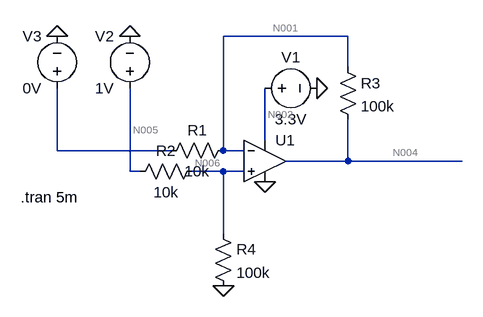
[diagram p0: schematic Draft1.asc]
Draft1.asc, the LTspice schematic file:
Version 4
SHEET 1 980 680
WIRE -272 -64 -464 -64
WIRE -272 -16 -272 -64
WIRE -400 96 -400 16
WIRE -720 112 -720 16
WIRE -544 112 -720 112
WIRE -464 112 -464 -64
WIRE -432 112 -464 112
WIRE -272 128 -272 64
WIRE -272 128 -368 128
WIRE -96 128 -272 128
WIRE -608 144 -608 16
WIRE -592 144 -608 144
WIRE -464 144 -512 144
WIRE -432 144 -464 144
WIRE -464 240 -464 144
FLAG -400 160 0
FLAG -320 16 0
FLAG -720 -64 0
FLAG -608 -64 0
FLAG -464 320 0
SYMBOL Linear_Original\\Opamps\\UniversalOpamp2 -400 128 R0
SYMATTR InstName U1
SYMBOL voltage -416 16 R270
WINDOW 0 32 56 VTop 2
WINDOW 3 -32 56 VBottom 2
SYMATTR InstName V1
SYMATTR Value 3.3V
SYMBOL voltage -608 32 R180
WINDOW 0 24 96 Left 2
WINDOW 3 24 16 Left 2
SYMATTR InstName V2
SYMATTR Value 1V
SYMBOL voltage -720 32 R180
WINDOW 0 24 96 Left 2
WINDOW 3 24 16 Left 2
SYMATTR InstName V3
SYMATTR Value 0V
SYMBOL res -448 96 R90
WINDOW 0 0 56 VBottom 2
WINDOW 3 32 56 VTop 2
SYMATTR InstName R1
SYMATTR Value 10k
SYMBOL res -496 128 R90
WINDOW 0 0 56 VBottom 2
WINDOW 3 32 56 VTop 2
SYMATTR InstName R2
SYMATTR Value 10k
SYMBOL res -288 -32 R0
SYMATTR InstName R3
SYMATTR Value 100k
SYMBOL res -480 224 R0
SYMATTR InstName R4
SYMATTR Value 100k
TEXT -776 184 Left 2 !.tran 5m

The netlist it stands for:
* Draft1.asc
XU1 N006 N001 N002 0 N004 level.2 Avol=1Meg GBW=10Meg Slew=10Meg ilimit=25m rail=0 Vos=0 phimargin=45 en=0 enk=0 in=0 ink=0 Rin=500Meg  ; pins IN+ IN- V+ V- OUT
V1 N002 0 3.3V
V2 N005 0 1V
V3 N003 0 0V
R1 N001 N003 10k
R2 N006 N005 10k
R3 N001 N004 100k
R4 N006 0 100k
.tran 5m
.lib UniversalOpamps2.sub
.backanno
.end

* Results of the author's LTspice run, read from the files saved beside the schematic
* Operating Point, zero values left out:
*   V(n004) = 3.3 V
*   V(n002) = 3.3 V
*   V(n001) = 300 mV
*   V(n006) = 909.1 mV
*   V(n005) = 1 V
*   I(R4) = 9.091 µA
*   I(R3) = -30 µA
*   I(R2) = -9.09 µA
*   I(R1) = 30 µA
*   I(V3) = 30 µA
*   I(V2) = -9.09 µA
*   I(V1) = -30.34 µA
*   Ix(u1:1) = -1.482 nA
*   Ix(u1:2) = -2.7 nA
*   Ix(u1:3) = 30.34 µA
*   Ix(u1:4) = -403 nA
*   Ix(u1:5) = -30 µA